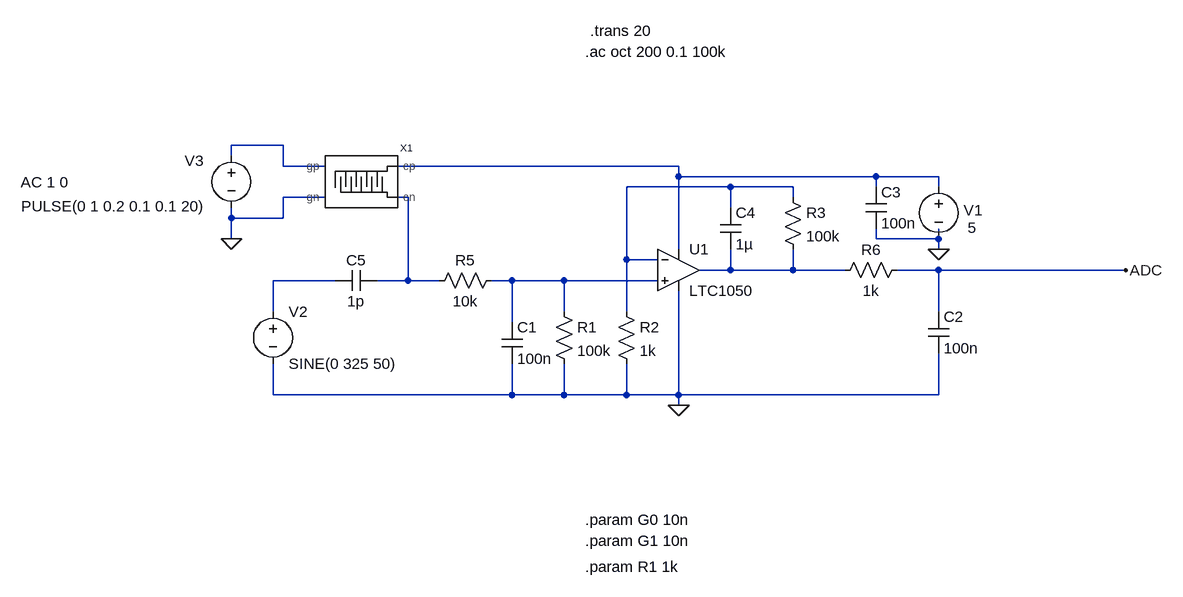
[diagram p0: schematic Circuit_ampli_Projet_Capteur.asc]
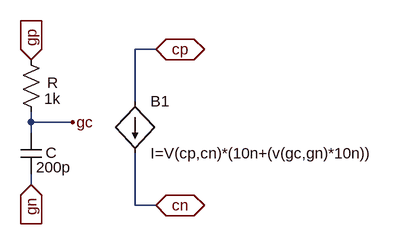
[diagram p1: sub-circuit capteur_graphite.asc]
Circuit_ampli_Projet_Capteur.asc, the LTspice schematic file:
Version 4
SHEET 1 992 680
WIRE -368 -96 -448 -96
WIRE -448 -80 -448 -96
WIRE -368 -64 -368 -96
WIRE -304 -64 -368 -64
WIRE 240 -64 -192 -64
WIRE 240 -48 240 -64
WIRE 544 -48 240 -48
WIRE 640 -48 544 -48
WIRE 320 -32 160 -32
WIRE 416 -32 320 -32
WIRE 544 -32 544 -48
WIRE 640 -32 640 -48
WIRE -304 -16 -368 -16
WIRE -176 -16 -192 -16
WIRE 416 -16 416 -32
WIRE 320 0 320 -32
WIRE -448 16 -448 0
WIRE -368 16 -368 -16
WIRE -368 16 -448 16
WIRE -448 48 -448 16
WIRE 544 48 544 32
WIRE 640 48 640 32
WIRE 640 48 544 48
WIRE 240 64 240 -48
WIRE 640 64 640 48
WIRE 160 80 160 -32
WIRE 208 80 160 80
WIRE 320 96 320 64
WIRE 320 96 272 96
WIRE 416 96 416 64
WIRE 416 96 320 96
WIRE 496 96 416 96
WIRE 640 96 576 96
WIRE 928 96 640 96
WIRE -288 112 -384 112
WIRE -176 112 -176 -16
WIRE -176 112 -224 112
WIRE -128 112 -176 112
WIRE -16 112 -48 112
WIRE 64 112 -16 112
WIRE 208 112 64 112
WIRE -384 160 -384 112
WIRE 64 160 64 112
WIRE 160 160 160 80
WIRE 640 160 640 96
WIRE -16 176 -16 112
WIRE -384 288 -384 240
WIRE -16 288 -16 240
WIRE -16 288 -384 288
WIRE 64 288 64 240
WIRE 64 288 -16 288
WIRE 160 288 160 240
WIRE 160 288 64 288
WIRE 240 288 240 128
WIRE 240 288 160 288
WIRE 640 288 640 224
WIRE 640 288 240 288
WIRE 240 304 240 288
FLAG 240 304 0
FLAG 640 64 0
FLAG -448 48 0
FLAG 928 96 ADC
SYMBOL OpAmps\\LTC1050 240 32 R0
SYMATTR InstName U1
SYMBOL res 48 144 R0
SYMATTR InstName R1
SYMATTR Value 100k
SYMBOL res 144 144 R0
SYMATTR InstName R2
SYMATTR Value 1k
SYMBOL cap -32 176 R0
SYMATTR InstName C1
SYMATTR Value 100n
SYMBOL res 400 -32 R0
SYMATTR InstName R3
SYMATTR Value 100k
SYMBOL res -32 96 R90
WINDOW 0 0 56 VBottom 2
WINDOW 3 32 56 VTop 2
SYMATTR InstName R5
SYMATTR Value 10k
SYMBOL cap 624 160 R0
SYMATTR InstName C2
SYMATTR Value 100n
SYMBOL cap 304 0 R0
SYMATTR InstName C4
SYMATTR Value 1µ
SYMBOL res 592 80 R90
WINDOW 0 0 56 VBottom 2
WINDOW 3 32 56 VTop 2
SYMATTR InstName R6
SYMATTR Value 1k
SYMBOL Capteur_Graphite -256 -48 R0
SYMATTR InstName X1
SYMBOL voltage 640 -48 R0
WINDOW 0 39 52 Left 2
WINDOW 3 45 79 Left 2
SYMATTR InstName V1
SYMATTR Value 5
SYMBOL voltage -448 -96 R0
WINDOW 0 -72 24 Left 2
WINDOW 3 -323 94 Left 2
WINDOW 123 -324 57 Left 2
WINDOW 39 0 0 Left 0
SYMATTR InstName V3
SYMATTR Value PULSE(0 1 0.2 0.1 0.1 20)
SYMATTR Value2 AC 1 0
SYMBOL cap 528 -32 R0
SYMATTR InstName C3
SYMATTR Value 100n
SYMBOL cap -224 96 R90
WINDOW 0 0 32 VBottom 2
WINDOW 3 32 32 VTop 2
SYMATTR InstName C5
SYMATTR Value 1p
SYMBOL voltage -384 144 R0
WINDOW 123 24 124 Left 2
WINDOW 39 0 0 Left 0
SYMATTR InstName V2
SYMATTR Value SINE(0 325 50)
TEXT 96 -240 Left 2 !.ac oct 200 0.1 100k
TEXT 96 480 Left 2 !.param G0 10n
TEXT 96 512 Left 2 !.param G1 10n
TEXT 96 552 Left 2 !.param R1 1k
TEXT 104 -272 Left 2 !.trans 20

capteur_graphite.asc, the sub-circuit schematic file:
Version 4
SHEET 1 880 680
WIRE 304 -32 272 -32
WIRE 272 48 272 -32
WIRE 112 80 112 64
WIRE 176 80 112 80
WIRE 112 96 112 80
WIRE 112 176 112 160
WIRE 272 208 272 128
WIRE 304 208 272 208
FLAG 112 -16 gp
IOPIN 112 -16 In
FLAG 112 176 gn
IOPIN 112 176 In
FLAG 176 80 gc
FLAG 304 -32 cp
IOPIN 304 -32 BiDir
FLAG 304 208 cn
IOPIN 304 208 BiDir
SYMBOL res 96 -32 R0
WINDOW 0 41 51 Left 2
SYMATTR InstName R
SYMATTR Value 1k
SYMBOL cap 96 96 R0
WINDOW 0 38 31 Left 2
WINDOW 3 24 53 Left 2
SYMATTR InstName C
SYMATTR Value 200p
SYMBOL bi 272 48 R0
SYMATTR InstName B1
SYMATTR Value I=V(cp,cn)*(10n+(v(gc,gn)*10n))

The netlist it stands for:
* Circuit_ampli_Projet_Capteur.asc
XU1 N007 N003 N002 0 N005 LTC1050  ; pins In+ In- V+ V- OUT
R1 N007 0 100k
R2 N003 0 1k
C1 N007 0 100n
R3 N003 N005 100k
R5 N007 N004 10k
C2 ADC 0 100n
C4 N003 N005 1µ
R6 ADC N005 1k
XX1 N001 0 N002 N004 capteur_graphite
V1 N002 0 5
V3 N001 0 PULSE(0 1 0.2 0.1 0.1 20) AC 1 0
C3 N002 0 100n
C5 N004 N006 1p
V2 N006 0 SINE(0 325 50)

* block symbol definitions
.subckt capteur_graphite gp gn cp cn
R gp gc 1k
C gc gn 200p
B1 cp cn I=V(cp,cn)*(10n+(v(gc,gn)*10n))
.ends capteur_graphite

.ac oct 200 0.1 100k
.param G0 10n
.param G1 10n
.param R1 1k
.trans 20
.lib LTC.lib
.backanno
.end